# EAGLE schematic Full Keyboard (EAGLE 9.1.1)
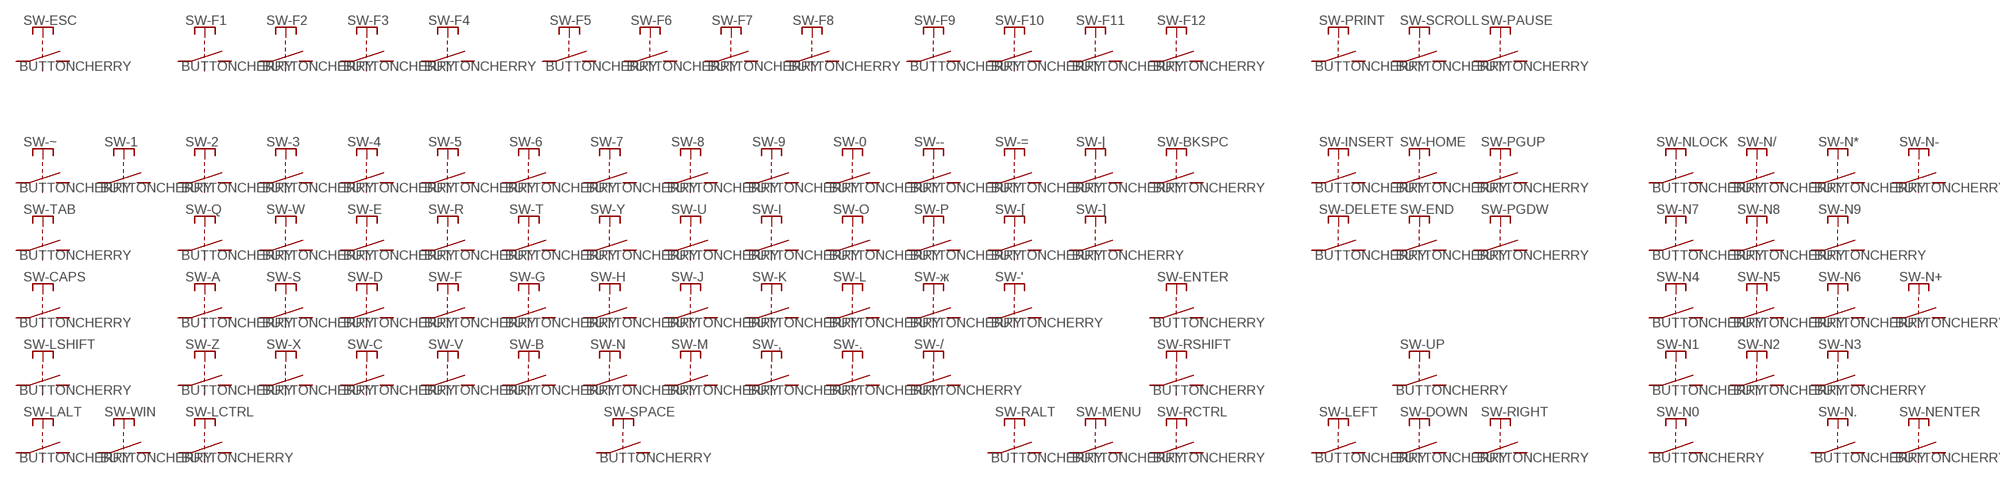
[diagram p0: schematic, sheet 1]

## Parts
SW-0  BUTTONCHERRY  [SW_GATERON]
SW-1  BUTTONCHERRY  [SW_GATERON]
SW-2  BUTTONCHERRY  [SW_GATERON]
SW-3  BUTTONCHERRY  [SW_GATERON]
SW-4  BUTTONCHERRY  [SW_GATERON]
SW-5  BUTTONCHERRY  [SW_GATERON]
SW-6  BUTTONCHERRY  [SW_GATERON]
SW-7  BUTTONCHERRY  [SW_GATERON]
SW-8  BUTTONCHERRY  [SW_GATERON]
SW-9  BUTTONCHERRY  [SW_GATERON]
SW-'  BUTTONCHERRY  [SW_GATERON]
SW-,  BUTTONCHERRY  [SW_GATERON]
SW--  BUTTONCHERRY  [SW_GATERON]
SW-.  BUTTONCHERRY  [SW_GATERON]
SW-/  BUTTONCHERRY  [SW_GATERON]
SW-=  BUTTONCHERRY  [SW_GATERON]
SW-[  BUTTONCHERRY  [SW_GATERON]
SW-]  BUTTONCHERRY  [SW_GATERON]
SW-A  BUTTONCHERRY  [SW_GATERON]
SW-B  BUTTONCHERRY  [SW_GATERON]
SW-BKSPC  BUTTONCHERRY  [SW_GATERON]
SW-C  BUTTONCHERRY  [SW_GATERON]
SW-CAPS  BUTTONCHERRY  [SW_GATERON]
SW-D  BUTTONCHERRY  [SW_GATERON]
SW-DELETE  BUTTONCHERRY  [SW_GATERON]
SW-DOWN  BUTTONCHERRY  [SW_GATERON]
SW-E  BUTTONCHERRY  [SW_GATERON]
SW-END  BUTTONCHERRY  [SW_GATERON]
SW-ENTER  BUTTONCHERRY  [SW_GATERON]
SW-ESC  BUTTONCHERRY  [SW_GATERON]
SW-F  BUTTONCHERRY  [SW_GATERON]
SW-F1  BUTTONCHERRY  [SW_GATERON]
SW-F2  BUTTONCHERRY  [SW_GATERON]
SW-F3  BUTTONCHERRY  [SW_GATERON]
SW-F4  BUTTONCHERRY  [SW_GATERON]
SW-F5  BUTTONCHERRY  [SW_GATERON]
SW-F6  BUTTONCHERRY  [SW_GATERON]
SW-F7  BUTTONCHERRY  [SW_GATERON]
SW-F8  BUTTONCHERRY  [SW_GATERON]
SW-F9  BUTTONCHERRY  [SW_GATERON]
SW-F10  BUTTONCHERRY  [SW_GATERON]
SW-F11  BUTTONCHERRY  [SW_GATERON]
SW-F12  BUTTONCHERRY  [SW_GATERON]
SW-G  BUTTONCHERRY  [SW_GATERON]
SW-H  BUTTONCHERRY  [SW_GATERON]
SW-HOME  BUTTONCHERRY  [SW_GATERON]
SW-I  BUTTONCHERRY  [SW_GATERON]
SW-INSERT  BUTTONCHERRY  [SW_GATERON]
SW-J  BUTTONCHERRY  [SW_GATERON]
SW-K  BUTTONCHERRY  [SW_GATERON]
SW-L  BUTTONCHERRY  [SW_GATERON]
SW-LALT  BUTTONCHERRY  [SW_GATERON]
SW-LCTRL  BUTTONCHERRY  [SW_GATERON]
SW-LEFT  BUTTONCHERRY  [SW_GATERON]
SW-LSHIFT  BUTTONCHERRY  [SW_GATERON]
SW-M  BUTTONCHERRY  [SW_GATERON]
SW-MENU  BUTTONCHERRY  [SW_GATERON]
SW-N  BUTTONCHERRY  [SW_GATERON]
SW-N0  BUTTONCHERRY  [SW_GATERON]
SW-N1  BUTTONCHERRY  [SW_GATERON]
SW-N2  BUTTONCHERRY  [SW_GATERON]
SW-N3  BUTTONCHERRY  [SW_GATERON]
SW-N4  BUTTONCHERRY  [SW_GATERON]
SW-N5  BUTTONCHERRY  [SW_GATERON]
SW-N6  BUTTONCHERRY  [SW_GATERON]
SW-N7  BUTTONCHERRY  [SW_GATERON]
SW-N8  BUTTONCHERRY  [SW_GATERON]
SW-N9  BUTTONCHERRY  [SW_GATERON]
SW-N*  BUTTONCHERRY  [SW_GATERON]
SW-N+  BUTTONCHERRY  [SW_GATERON]
SW-N-  BUTTONCHERRY  [SW_GATERON]
SW-N.  BUTTONCHERRY  [SW_GATERON]
SW-N/  BUTTONCHERRY  [SW_GATERON]
SW-NENTER  BUTTONCHERRY  [SW_GATERON]
SW-NLOCK  BUTTONCHERRY  [SW_GATERON]
SW-O  BUTTONCHERRY  [SW_GATERON]
SW-P  BUTTONCHERRY  [SW_GATERON]
SW-PAUSE  BUTTONCHERRY  [SW_GATERON]
SW-PGDW  BUTTONCHERRY  [SW_GATERON]
SW-PGUP  BUTTONCHERRY  [SW_GATERON]
SW-PRINT  BUTTONCHERRY  [SW_GATERON]
SW-Q  BUTTONCHERRY  [SW_GATERON]
SW-R  BUTTONCHERRY  [SW_GATERON]
SW-RALT  BUTTONCHERRY  [SW_GATERON]
SW-RCTRL  BUTTONCHERRY  [SW_GATERON]
SW-RIGHT  BUTTONCHERRY  [SW_GATERON]
SW-RSHIFT  BUTTONCHERRY  [SW_GATERON]
SW-S  BUTTONCHERRY  [SW_GATERON]
SW-SCROLL  BUTTONCHERRY  [SW_GATERON]
SW-SPACE  BUTTONCHERRY  [SW_GATERON]
SW-T  BUTTONCHERRY  [SW_GATERON]
SW-TAB  BUTTONCHERRY  [SW_GATERON]
SW-U  BUTTONCHERRY  [SW_GATERON]
SW-UP  BUTTONCHERRY  [SW_GATERON]
SW-V  BUTTONCHERRY  [SW_GATERON]
SW-W  BUTTONCHERRY  [SW_GATERON]
SW-WIN  BUTTONCHERRY  [SW_GATERON]
SW-X  BUTTONCHERRY  [SW_GATERON]
SW-Y  BUTTONCHERRY  [SW_GATERON]
SW-Z  BUTTONCHERRY  [SW_GATERON]
SW-|  BUTTONCHERRY  [SW_GATERON]
SW-~  BUTTONCHERRY  [SW_GATERON]
SW-ж  BUTTONCHERRY  [SW_GATERON]
Unconnected: SW-0.P$1 SW-0.P$2 SW-1.P$1 SW-1.P$2 SW-2.P$1 SW-2.P$2 SW-3.P$1 SW-3.P$2 SW-4.P$1 SW-4.P$2 SW-5.P$1 SW-5.P$2 SW-6.P$1 SW-6.P$2 SW-7.P$1 SW-7.P$2 SW-8.P$1 SW-8.P$2 SW-9.P$1 SW-9.P$2 SW-'.P$1 SW-'.P$2 SW-,.P$1 SW-,.P$2 SW--.P$1 SW--.P$2 SW-..P$1 SW-..P$2 SW-/.P$1 SW-/.P$2 SW-=.P$1 SW-=.P$2 SW-[.P$1 SW-[.P$2 SW-].P$1 SW-].P$2 SW-A.P$1 SW-A.P$2 SW-B.P$1 SW-B.P$2 SW-BKSPC.P$1 SW-BKSPC.P$2 SW-C.P$1 SW-C.P$2 SW-CAPS.P$1 SW-CAPS.P$2 SW-D.P$1 SW-D.P$2 SW-DELETE.P$1 SW-DELETE.P$2 SW-DOWN.P$1 SW-DOWN.P$2 SW-E.P$1 SW-E.P$2 SW-END.P$1 SW-END.P$2 SW-ENTER.P$1 SW-ENTER.P$2 SW-ESC.P$1 SW-ESC.P$2 SW-F1.P$1 SW-F1.P$2 SW-F2.P$1 SW-F2.P$2 SW-F3.P$1 SW-F3.P$2 SW-F4.P$1 SW-F4.P$2 SW-F5.P$1 SW-F5.P$2 SW-F6.P$1 SW-F6.P$2 SW-F7.P$1 SW-F7.P$2 SW-F8.P$1 SW-F8.P$2 SW-F9.P$1 SW-F9.P$2 SW-F10.P$1 SW-F10.P$2 SW-F11.P$1 SW-F11.P$2 SW-F12.P$1 SW-F12.P$2 SW-F.P$1 SW-F.P$2 SW-G.P$1 SW-G.P$2 SW-H.P$1 SW-H.P$2 SW-HOME.P$1 SW-HOME.P$2 SW-I.P$1 SW-I.P$2 SW-INSERT.P$1 SW-INSERT.P$2 SW-J.P$1 SW-J.P$2 SW-K.P$1 SW-K.P$2 SW-L.P$1 SW-L.P$2 SW-LALT.P$1 SW-LALT.P$2 SW-LCTRL.P$1 SW-LCTRL.P$2 SW-LEFT.P$1 SW-LEFT.P$2 SW-LSHIFT.P$1 SW-LSHIFT.P$2 SW-M.P$1 SW-M.P$2 SW-MENU.P$1 SW-MENU.P$2 SW-N0.P$1 SW-N0.P$2 SW-N1.P$1 SW-N1.P$2 SW-N2.P$1 SW-N2.P$2 SW-N3.P$1 SW-N3.P$2 SW-N4.P$1 SW-N4.P$2 SW-N5.P$1 SW-N5.P$2 SW-N6.P$1 SW-N6.P$2 SW-N7.P$1 SW-N7.P$2 SW-N8.P$1 SW-N8.P$2 SW-N9.P$1 SW-N9.P$2 SW-N*.P$1 SW-N*.P$2 SW-N+.P$1 SW-N+.P$2 SW-N-.P$1 SW-N-.P$2 SW-N..P$1 SW-N..P$2 SW-N.P$1 SW-N.P$2 SW-N/.P$1 SW-N/.P$2 SW-NENTER.P$1 SW-NENTER.P$2 SW-NLOCK.P$1 SW-NLOCK.P$2 SW-O.P$1 SW-O.P$2 SW-P.P$1 SW-P.P$2 SW-PAUSE.P$1 SW-PAUSE.P$2 SW-PGDW.P$1 SW-PGDW.P$2 SW-PGUP.P$1 SW-PGUP.P$2 SW-PRINT.P$1 SW-PRINT.P$2 SW-Q.P$1 SW-Q.P$2 SW-R.P$1 SW-R.P$2 SW-RALT.P$1 SW-RALT.P$2 SW-RCTRL.P$1 SW-RCTRL.P$2 SW-RIGHT.P$1 SW-RIGHT.P$2 SW-RSHIFT.P$1 SW-RSHIFT.P$2 SW-S.P$1 SW-S.P$2 SW-SCROLL.P$1 SW-SCROLL.P$2 SW-SPACE.P$1 SW-SPACE.P$2 SW-T.P$1 SW-T.P$2 SW-TAB.P$1 SW-TAB.P$2 SW-U.P$1 SW-U.P$2 SW-UP.P$1 SW-UP.P$2 SW-V.P$1 SW-V.P$2 SW-W.P$1 SW-W.P$2 SW-WIN.P$1 SW-WIN.P$2 SW-X.P$1 SW-X.P$2 SW-Y.P$1 SW-Y.P$2 SW-Z.P$1 SW-Z.P$2 SW-|.P$1 SW-|.P$2 SW-~.P$1 SW-~.P$2 SW-ж.P$1 SW-ж.P$2

## Library data of the parts
SW-0 SW-1-SW-9 SW-' SW-, SW-- SW-. SW-/ SW-= SW-[ SW-] SW-A SW-B SW-BKSPC SW-C SW-CAPS SW-D SW-DELETE SW-DOWN SW-E SW-END SW-ENTER SW-ESC SW-F SW-F1-SW-F12 SW-G SW-H SW-HOME SW-I SW-INSERT SW-J SW-K SW-L SW-LALT SW-LCTRL SW-LEFT SW-LSHIFT SW-M SW-MENU SW-N SW-N0 SW-N1-SW-N9 SW-N* SW-N+ SW-N- SW-N. SW-N/ SW-NENTER SW-NLOCK SW-O SW-P SW-PAUSE SW-PGDW SW-PGUP SW-PRINT SW-Q SW-R SW-RALT SW-RCTRL SW-RIGHT SW-RSHIFT SW-S SW-SCROLL SW-SPACE SW-T SW-TAB SW-U SW-UP SW-V SW-W SW-WIN SW-X SW-Y SW-Z SW-| SW-~ SW-ж = Flamberm:BUTTON